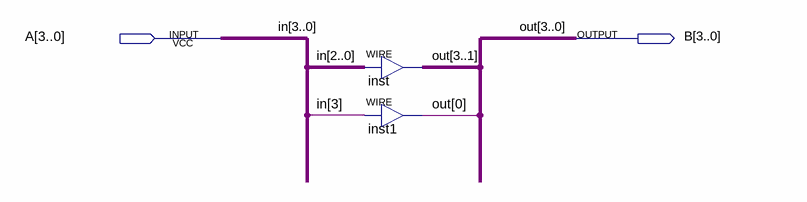
[diagram p0: schematic sheet]
// Quartus schematic shifter_4b.bdf as structural Verilog: 2 symbols, 2 pins
module shifter_4b (
  input  [3:0] A,
  output [3:0] B
);

  assign B[3:1] = A[2:0];  // WIRE inst
  assign B[0] = A[3];  // WIRE inst1

  // Other names for the same wires on the sheet: in[3:0] = A; out[3:0] = B
endmodule
